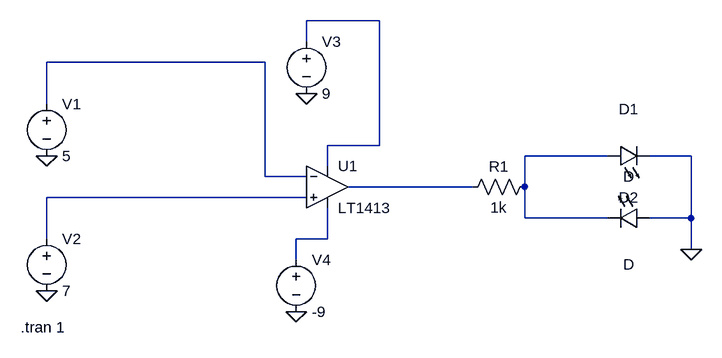
[diagram p0: schematic Draft2.asc]
Draft2.asc, the LTspice schematic file:
Version 4
SHEET 1 1140 680
WIRE 640 -64 528 -64
WIRE 528 -32 528 -64
WIRE 464 0 128 0
WIRE 128 64 128 0
WIRE 640 128 640 -64
WIRE 640 128 560 128
WIRE 992 144 864 144
WIRE 1120 144 1056 144
WIRE 560 160 560 128
WIRE 464 176 464 0
WIRE 528 176 464 176
WIRE 784 192 592 192
WIRE 864 192 864 144
WIRE 528 208 128 208
WIRE 864 240 864 192
WIRE 992 240 864 240
WIRE 1120 240 1120 144
WIRE 1120 240 1056 240
WIRE 128 272 128 208
WIRE 560 272 560 224
WIRE 560 272 512 272
WIRE 1120 288 1120 240
WIRE 512 304 512 272
FLAG 128 352 0
FLAG 128 144 0
FLAG 512 384 0
FLAG 528 48 0
FLAG 1120 288 0
SYMBOL voltage 128 48 R0
WINDOW 123 0 0 Left 0
WINDOW 39 0 0 Left 0
SYMATTR InstName V1
SYMATTR Value 5
SYMBOL voltage 128 256 R0
WINDOW 123 0 0 Left 0
WINDOW 39 0 0 Left 0
SYMATTR InstName V2
SYMATTR Value 7
SYMBOL OpAmps\\LT1413 560 128 R0
SYMATTR InstName U1
SYMBOL voltage 528 -48 R0
WINDOW 123 0 0 Left 0
WINDOW 39 0 0 Left 0
SYMATTR InstName V3
SYMATTR Value 9
SYMBOL voltage 512 288 R0
WINDOW 123 0 0 Left 0
WINDOW 39 0 0 Left 0
SYMATTR InstName V4
SYMATTR Value -9
SYMBOL res 880 176 R90
WINDOW 0 0 56 VBottom 2
WINDOW 3 32 56 VTop 2
SYMATTR InstName R1
SYMATTR Value 1k
SYMBOL LED 992 160 R270
WINDOW 0 72 32 VTop 2
WINDOW 3 0 32 VBottom 2
SYMATTR InstName D1
SYMBOL LED 1056 224 R90
WINDOW 0 0 32 VBottom 2
WINDOW 3 72 32 VTop 2
SYMATTR InstName D2
TEXT 88 408 Left 2 !.tran 1

The netlist it stands for:
* Draft2.asc
V1 N002 0 5
V2 N005 0 7
XU1 N005 N002 N001 N006 N004 LT1413  ; pins In+ In- V+ V- OUT
V3 N001 0 9
V4 N006 0 -9
R1 N003 N004 1k
D1 N003 0 D
D2 0 N003 D
.model D D
.lib standard.dio
.tran 1
.lib LTC.lib
.backanno
.end